# Altium project MEMS_V3.PrjPcb
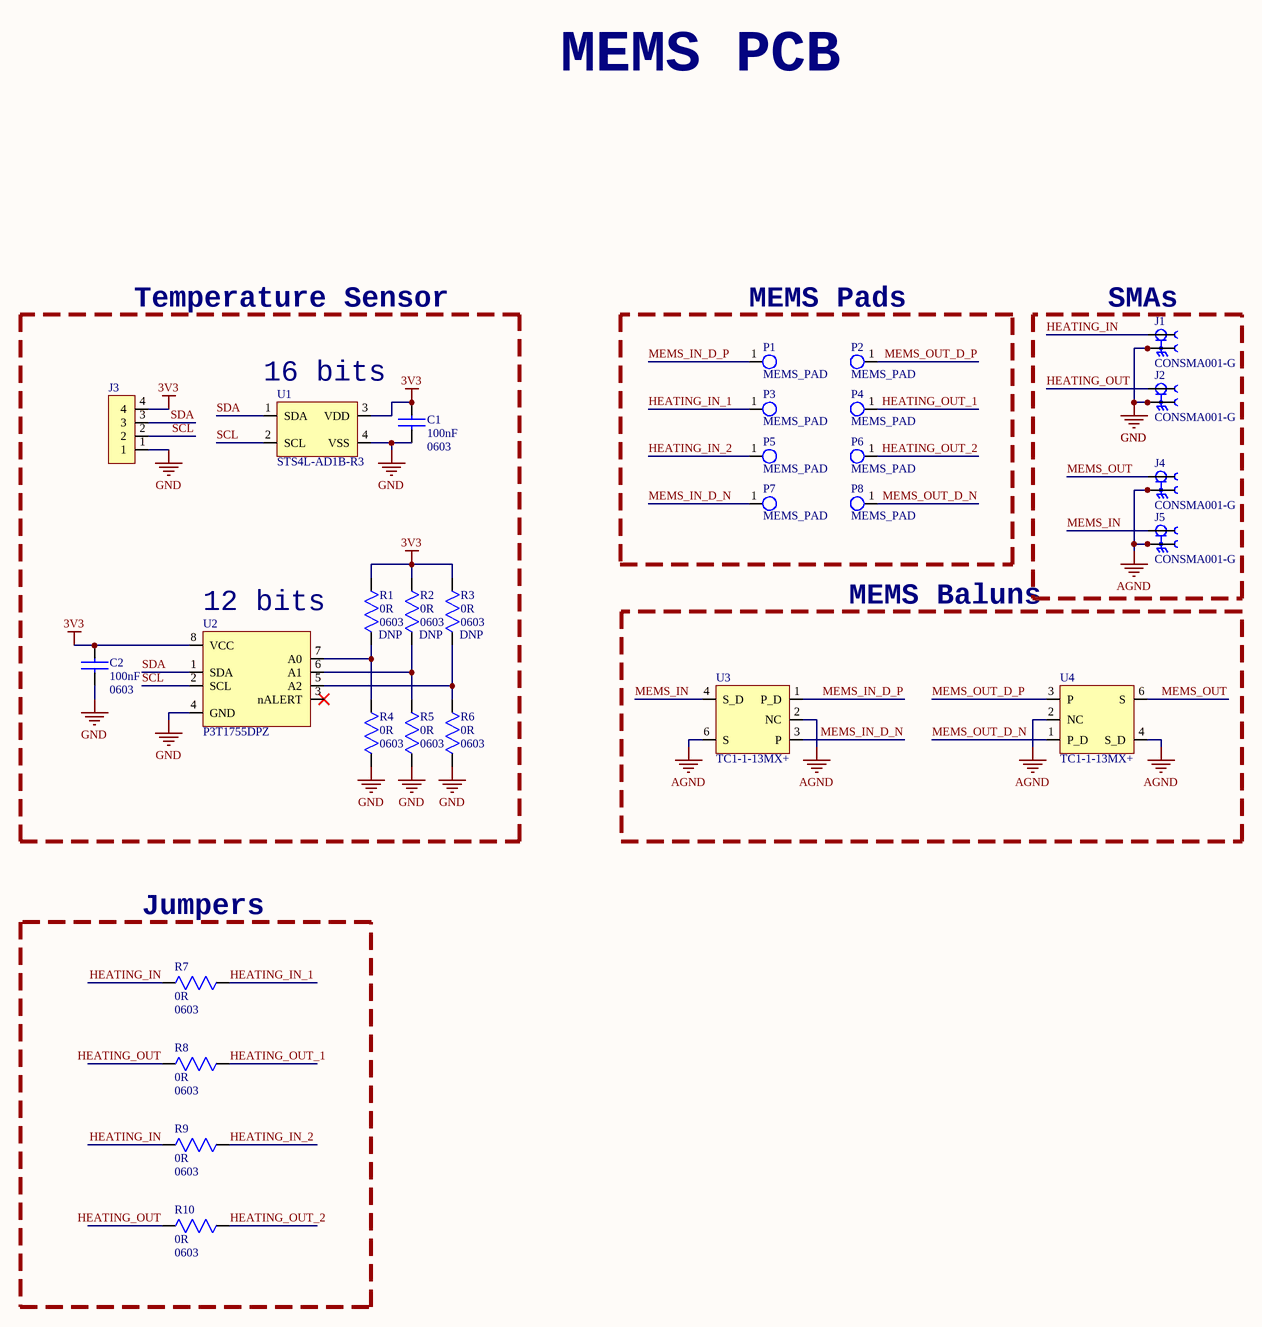
[diagram p0: MEMS_V3.SchDoc]
1 sheet, 29 parts. Net scope: global (net labels, ports and power ports of the same name join across sheets).
Board file: MEMS_V3_PCB.PcbDoc

## Sheet MEMS_V3.SchDoc
size 381 x 279 mm; Organization: SACO Technologies; Address1: 7806, Trans-Canada Hwy; Address2: Montreal, QC, Canada - H4S1L3.; Address3: H4S1L3; SheetNumber: 1; SheetTotal: 1; ELE682ProjectName: MEMS Board; SchDesignedBy1: Alexis Gagnon; SchDesignedBy2: Megane Cyr; ProjectRevision: C

### Parts
C1  value 100nF  Case: 0603  [C0603]  (hidden comment: CL10E104KC8VPNC)
C2  value 100nF  Case: 0603  [C0603]  (hidden comment: CL10E104KC8VPNC)
J1  CONSMA001-G  [CONSMA001-G]
J2  CONSMA001-G  [CONSMA001-G]
J3  61300411121  [WURTH_61300411121]  (value not drawn)
J4  CONSMA001-G  [CONSMA001-G]
J5  CONSMA001-G  [CONSMA001-G]
P1  MEMS_PAD  [MEMS_PAD]
P2  MEMS_PAD  [MEMS_PAD]
P3  MEMS_PAD  [MEMS_PAD]
P4  MEMS_PAD  [MEMS_PAD]
P5  MEMS_PAD  [MEMS_PAD]
P6  MEMS_PAD  [MEMS_PAD]
P7  MEMS_PAD  [MEMS_PAD]
P8  MEMS_PAD  [MEMS_PAD]
R1  value 0R  Package: 0603  [R0603]  (hidden comment: RMCF0603ZT0R00)
R2  value 0R  Package: 0603  [R0603]  (hidden comment: RMCF0603ZT0R00)
R3  value 0R  Package: 0603  [R0603]  (hidden comment: RMCF0603ZT0R00)
R4  value 0R  Package: 0603  [R0603]  (hidden comment: RMCF0603ZT0R00)
R5  value 0R  Package: 0603  [R0603]  (hidden comment: RMCF0603ZT0R00)
R6  value 0R  Package: 0603  [R0603]  (hidden comment: RMCF0603ZT0R00)
R7  value 0R  Package: 0603  [R0603]  (hidden comment: RMCF0603ZT0R00)
R8  value 0R  Package: 0603  [R0603]  (hidden comment: RMCF0603ZT0R00)
R9  value 0R  Package: 0603  [R0603]  (hidden comment: RMCF0603ZT0R00)
R10  value 0R  Package: 0603  [R0603]  (hidden comment: RMCF0603ZT0R00)
U1  STS4L-AD1B-R3  [STS4L-AD1B-R3]
U2  P3T1755DPZ  [TSSOP8_P3T1755DPZ_NXP]
U3  TC1-1-13MX+  [TC1-1-13MX+]
U4  TC1-1-13MX+  [TC1-1-13MX+]

### Blocks framed on the sheet
MEMS Pads: P1-P8
SMAs: J1 J2 J4 J5
MEMS Baluns: U3 U4
Jumpers: R7-R10

### Nets
3V3: C1.1 C2.1 J3.4 R1.2 R2.2 R3.2 U1.3(VDD) U2.8(VCC)
AGND: J4.S1 J4.S2 J4.S3 J4.S4 J5.S1 J5.S2 J5.S3 J5.S4 U3.2(NC) U3.6(S) U4.2(NC) U4.4(S_D)
GND: C1.2 C2.2 J1.S1 J1.S2 J1.S3 J1.S4 J2.S1 J2.S2 J2.S3 J2.S4 J3.1 R4.1 R5.1 R6.1 U1.4(VSS) U2.4(GND)
HEATING_IN: J1.1 R7.1 R9.1
HEATING_IN_1: P3.1 R7.2
HEATING_IN_2: P5.1 R9.2
HEATING_OUT: J2.1 R8.1 R10.1
HEATING_OUT_1: P4.1 R8.2
HEATING_OUT_2: P6.1 R10.2
MEMS_IN: J5.1 U3.4(S_D)
MEMS_IN_D_N: P7.1 U3.3(P)
MEMS_IN_D_P: P1.1 U3.1(P_D)
MEMS_OUT: J4.1 U4.6(S)
MEMS_OUT_D_N: P8.1 U4.1(P_D)
MEMS_OUT_D_P: P2.1 U4.3(P)
SCL: J3.2 U1.2(SCL) U2.2(SCL)
SDA: J3.3 U1.1(SDA) U2.1(SDA)
NetR1_1: R1.1 R4.2 U2.7(A0)
NetR2_1: R2.1 R5.2 U2.6(A1)
NetR3_1: R3.1 R6.2 U2.5(A2)

Not connected (* = marked no-connect by the designer): U2 3(nALERT)*

### Notes on the sheet
- MEMS PCB
- Temperature Sensor
- (near U1) 16 bits
- (near U2) 12 bits
- (near R1) DNP
- (near R2) DNP
- (near R3) DNP
- Project:
- File:
- Date:
- Designed By :
- © COPYRIGHT 2024 École de Technologie Supérieure
- Revision:
- Sheet
- of
- 1100 Rue Notre-Dame Ouest, Montréal, QC H3C 1K3

### Library data of the parts
C1 C2 = CL10E104KC8VPNC: CAP CER 100NF 100V X8L 0603; Manufacturer: Samsung; Supplier: Digikey; Supplier Part Number: 1276-CL10E104KC8VPNCCT-ND; Manufacturer Part Number: CL10E104KC8VPNC; RoHS: No; Stock: 47712; Pricing: 1=0.27, 10=0.155, 50=0.1104, 100=0.0966, 500=0.07306, 1000=0.06573 (USD); Supplier 1: Mouser; Supplier Part Number 1: 187-CL10E104KC8VPNC
J1 J2 J4 J5 = CONSMA001-G: CONN SMA RCPT STR 50 OHM PCB
J3 = 61300411121: CONN HEADER VERT 4POS 2.54MM; MF: WÃ¼rth Elektronik; SnapEDA_Link: https://www.snapeda.com/parts/61300411121/W%25C3%25BCrth+Elektronik+Midcom/view-part/?ref=snap; Package: None; Value: *; MP: 61300411121; Check_prices: https://www.snapeda.com/parts/61300411121/W%25C3%25BCrth+Elektronik+Midcom/view-part/?ref=eda; Supplier 1: Newark; Supplier Part Number 1: 20X0951
P1-P8 = MEMS_PAD: PAD MEMS connection
R1-R6 = RMCF0603ZT0R00: RES 0 OHM JUMPER 1/10W 0603; MF: Stackpole Electronics; SnapEDA_Link: https://www.snapeda.com/parts/RMCF0603ZT0R00/Stackpole+Electronics+Inc/view-part/?ref=snap; MP: RMCF0603ZT0R00; Check_prices: https://www.snapeda.com/parts/RMCF0603ZT0R00/Stackpole+Electronics+Inc/view-part/?ref=eda; Supplier 1: DigiKey; Supplier Part Number 1: RMCF0603ZT0R00CT-ND
R7-R10 = RMCF0603ZT0R00_1: RES 0 OHM JUMPER 1/10W 0603; MF: Stackpole Electronics; SnapEDA_Link: https://www.snapeda.com/parts/RMCF0603ZT0R00/Stackpole+Electronics+Inc/view-part/?ref=snap; MP: RMCF0603ZT0R00; Check_prices: https://www.snapeda.com/parts/RMCF0603ZT0R00/Stackpole+Electronics+Inc/view-part/?ref=eda; Supplier 1: DigiKey; Supplier Part Number 1: RMCF0603ZT0R00CT-ND
U1 = STS4L-AD1B-R3: IC - TEMPERATURE SENSOR 4-DFN; Supplier 1: DigiKey; Supplier Part Number 1: 1649-STS4L-AD1B-R3CT-ND
U2 = P3T1755DPZ: SENSOR DGTL -40C ~ 125C 8-TSSOP; Supplier 1: DigiKey; Supplier Part Number 1: 568-P3T1755DPZCT-ND
U3 U4 = TC1-1-13MX+: 1:1 CORE & WIRE TRANSFORMER, 4.5

## Assembly variants
No sensor: not fitted C1 C2 J? R1 R2 R3 R4 R5 R6 U1 U2
16 bits sensor: not fitted C2 R1 R2 R3 R4 R5 R6 U2
12 bits sensor: not fitted C1 R1 R2 R3 U1